# EAGLE design lortinchen (EAGLE 9.3.0)
Assembly variants: ohne LDO
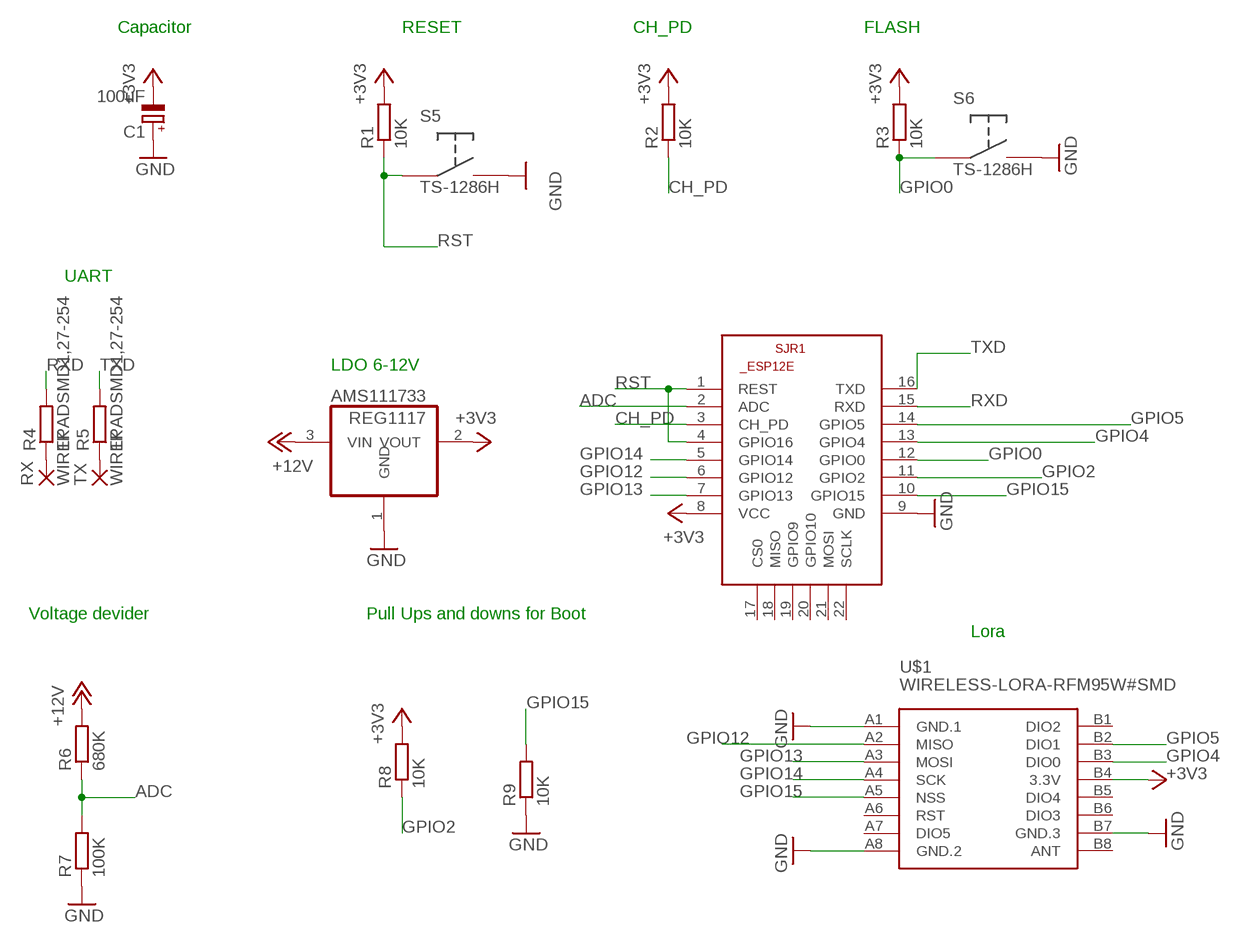
[diagram p0: schematic, sheet 1]

## Parts
AMS111733  REG1117  [SOT223]  (not fitted in variant ohne LDO)
C1  100uF  CPOL-EUC/6032-28R  [C/6032-28R]
R1  10K  R-EU_R0603  [R0603]
R2  10K  R-EU_R0603  [R0603]
R3  10K  R-EU_R0603  [R0603]
R4  1K  R-EU_R0603  [R0603]
R5  1K  R-EU_R0603  [R0603]
R6  680K  R-EU_R0603  [R0603]
R7  100K  R-EU_R0603  [R0603]
R8  10K  R-EU_R0603  [R0603]
R9  10K  R-EU_R0603  [R0603]
RX  WIREPADSMD1,27-254  [SMD1,27-2,54]
S5  TS-1286H  [TS-1268H]
S6  TS-1286H  [TS-1268H]
SJR1  ESP8266-12EESP12E  [ESP8266-ESP12E]
TX  WIREPADSMD1,27-254  [SMD1,27-2,54]
U$1  WIRELESS-LORA-RFM95W#SMD  [WIRELESS-LORA-RFM95W#SMD]

## Nets
+3V3 [Power]: AMS111733.2(VOUT) C1.- R1.2 R2.2 R3.2 R8.2 SJR1.8(VCC) U$1.B4(3.3V)
+12V [Power]: AMS111733.3(VIN) R6.2
ADC: R6.1 R7.2 SJR1.2(ADC)
CH_PD: R2.1 SJR1.3(CH_PD)
GND [Power]: AMS111733.1(GND) C1.+ R7.1 R9.1 S5.P$2 S6.P$2 SJR1.9(GND) U$1.A1(GND.1) U$1.A8(GND.2) U$1.B7(GND.3)
GPIO0: R3.1 S6.P$1 SJR1.12(GPIO0)
GPIO2: R8.1 SJR1.11(GPIO2)
GPIO4: SJR1.13(GPIO4) U$1.B3(DIO0)
GPIO5: SJR1.14(GPIO5) U$1.B2(DIO1)
GPIO12: SJR1.6(GPIO12) U$1.A2(MISO)
GPIO13: SJR1.7(GPIO13) U$1.A3(MOSI)
GPIO14: SJR1.5(GPIO14) U$1.A4(SCK)
GPIO15: R9.2 SJR1.10(GPIO15) U$1.A5(NSS)
N$1: R4.1 RX.1(P)
N$2: R5.1 TX.1(P)
RST: R1.1 S5.P$1 SJR1.1(REST) SJR1.4(GPIO16)
RXD: R4.2 SJR1.15(RXD)
TXD: R5.2 SJR1.16(TXD)
Unconnected: SJR1.17(CS0) SJR1.18(MISO) SJR1.19(GPIO9) SJR1.20(GPIO10) SJR1.21(MOSI) SJR1.22(SCLK) U$1.A6(RST) U$1.A7(DIO5) U$1.B1(DIO2) U$1.B5(DIO4) U$1.B6(DIO3) U$1.B8(ANT)

## Notes on the sheet
- Capacitor | RESET | CH_PD | FLASH
- UART
- LDO 6-12V
- Voltage devider | Pull Ups and downs for Boot
- Lora

## Library data of the parts
AMS111733 = burr-brown:REG1117: 800mA and 1A Low Dropout (LDO) Positive Regulator 1.8V, 2.5V, 2.85V, 3.3V, 5V, and Adj; MPN: REG1117; OC_FARNELL: 1097566; OC_NEWARK: 14P6981
C1 = rcl:CPOL-EU: POLARIZED CAPACITOR, European symbol; SPICEPREFIX: C
R1-R9 = rcl:R-EU_: RESISTOR, European symbol; SPICEPREFIX: R
RX TX = wirepad:WIREPAD: Wire PAD connect wire on PCB
S5 S6 = small-button:TS-1286H
SJR1 = esp12e:ESP8266-12E: ESP8266-12E Library for Eagle CAD The author not responsible for any damages or errors!. Created by Suhail jr.lt;/author>
U$1 = diy-modules:WIRELESS-LORA-RFM95W: 868/915 MHz LoRa Radio Transceiver Module based on SX1276 chip Click here to find device on ebay.com <http://www.ebay.com/sch/RFM95W+transceiver>

## Net classes
1 Power: width 0.254 mm, clearance 0.203 mm

## Board
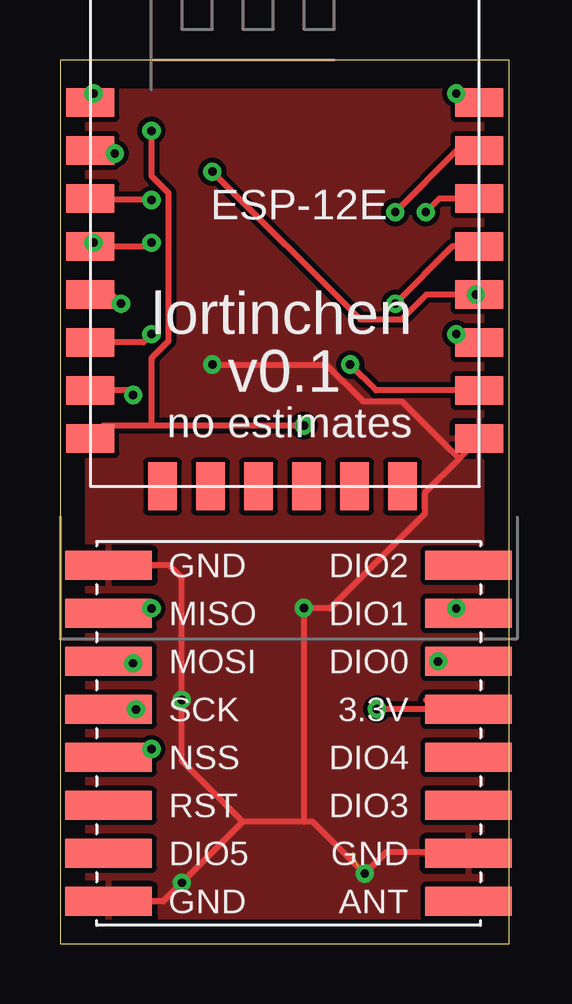
[diagram p1: board, top side]
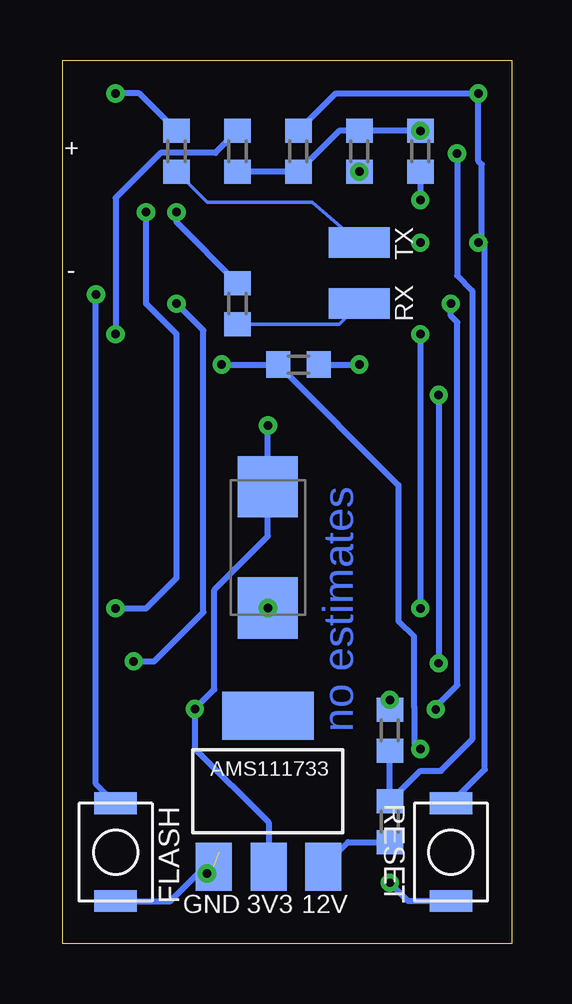
[diagram p2: board, bottom side, seen from below]

Size 18.72 x 36.82 mm. Coordinates in mm from the lower left corner, seen from the top.
Outline: 0,0 18.72,0 18.72,36.82 0,36.82 0,0
Copper layers (1*16): Top 0.035mm / dielectric 1.5mm / Bottom 0.035mm
Design rules "default *": minimum track width 6mil, minimum drill 0.35mm, track to track 6mil, track to pad 6mil, pad to pad 6mil, via to via 6mil, smd to smd 6mil, copper to edge 40mil, drill to drill 6mil, minimum pad ring 10mil, minimum via ring 8mil, stop-mask expansion 4mil, vias tented up to drill 15mil, thermal gap 10mil

### Footprints (pad centres in the part's own frame; a part is rotated, then mirrored left to right if it is on the bottom)
SOT223 = smd 1.499 x 2.007: 1 -2.261,-3.15; 2 0.025,-3.15; 3 2.311,-3.15 | smd 3.81 x 2.007: 4 0,3.15
C/6032-28R = smd 2.55 x 2.5: + 2.525,0; - -2.525,0
R0603 = smd 1 x 1.1: 1 -0.85,0; 2 0.85,0
SMD1,27-2,54 = smd 1.27 x 2.54: 1 0,0
TS-1268H = smd 0.914 x 1.778: P$1 -2.032,0; P$2 2.032,0
ESP8266-ESP12E = smd 2 x 1.2: 1 -7.62,5.84; 2 -7.62,3.84; 3 -7.62,1.84; 4 -7.62,-0.16; 5 -7.62,-2.16; 6 -7.62,-4.16; 7 -7.62,-6.16; 8 -7.62,-8.16; 9 8.58,-8.16; 10 8.58,-6.16; 11 8.58,-4.16; 12 8.58,-2.16; 13 8.58,-0.16; 14 8.58,1.84; 15 8.58,3.84; 16 8.58,5.84 | smd 1.2 x 2: 17 -4.62,-10.16; 18 -2.62,-10.16; 19 -0.62,-10.16; 20 1.38,-10.16; 21 3.38,-10.16; 22 5.38,-10.16
WIRELESS-LORA-RFM95W#SMD = smd 3.6 x 1.2: A1 -7.5,7; A2 -7.5,5; A3 -7.5,3; A4 -7.5,1; A5 -7.5,-1; A6 -7.5,-3; A7 -7.5,-5; A8 -7.5,-7; B1 7.5,7; B2 7.5,5; B3 7.5,3; B4 7.5,1; B5 7.5,-1; B6 7.5,-3; B7 7.5,-5; B8 7.5,-7

### Placement (x,y rotation side)
AMS111733  10.16,6.35 0 bottom  (not fitted)
C1  10.16,16.51 270 bottom
R1  8.89,33.02 270 bottom
R2  3.81,33.02 90 bottom
R3  6.35,33.02 90 bottom
R4  11.43,26.67 90 bottom
R5  13.97,33.02 90 bottom
R6  5.08,5.08 270 bottom
R7  5.08,8.89 270 bottom
R8  11.43,33.02 270 bottom
R9  8.89,24.13 180 bottom
RX  6.35,26.67 90 bottom
S5  2.54,3.81 270 bottom
S6  16.51,3.81 270 bottom
SJR1  8.89,29.21 0 top
TX  6.35,29.21 90 bottom
U$1  9.52,8.76 0 top

### Tracks (layer width: path | path; a pad name or v marks a point on that pad's centre or on a via)
+3V3  (via drill 0.35)
  Top 0.254: 15.24,10.16 15.64,9.76 U$1.B4 13.22,9.76 v13.21,9.78 | v10.16,21.59 3.81,21.59 | 3.81,21.59 1.81,21.59 SJR1.8 | R2.2 3.81,31.99 4.52,31.28 4.52,25.11 3.81,24.4 3.81,21.59
  Bottom 0.254: AMS111733.2 10.13,5.05 13.21,8.13 v13.21,9.78 12.39,10.59 12.39,14.74 10.16,16.98 C1.- v10.16,21.59 | R2.2 R3.2 7.19,33.87 R1.2 R8.2
  other vias: 3.81,33.87
+12V
  Bottom 0.254: AMS111733.3 6.82,4.23 R6.2
ADC  (via drill 0.35)
  Top 0.254: SJR1.2 2.16,33.05 v2.28,32.92
  Bottom 0.254: R7.2 R6.1 3.81,7.2 2.96,7.2 1.65,8.51 1.65,27.21 2.28,27.84 v2.28,32.92
CH_PD  (via drill 0.35)
  Top 0.254: v3.81,30.99 1.33,30.99 SJR1.3
  Bottom 0.254: R2.1 v3.81,30.99
GND  (via drill 0.35)  (1 unrouted)
  Top 0.254: U$1.A8 4.3,1.76 v5.08,2.54 7.62,5.08 | U$1.B7 16.98,3.81 13.59,3.81 v12.7,2.92 10.54,5.08 10.16,5.08 | C1.+ | C1.+ 10.16,5.08 | 10.16,5.08 7.62,5.08 | 7.62,5.08 5.08,7.62 v5.08,10.16 5.08,15.24 4.56,15.76 U$1.A1 | SJR1.9 16.62,20.2 | 16.62,20.2 15.2,18.78 15.2,17.91 11.26,13.97 C1.+ | 16.62,20.2 14.24,22.59 12.63,22.59 11.09,24.13 v6.35,24.13
  Bottom 0.254: S6.P$2 14.22,1.78 12.19,3.81 | R7.1 v5.08,10.16 | S5.P$2 4.32,1.78 v5.08,2.54 | AMS111733.1 v12.7,2.92 | R9.1 v6.35,24.13
  other vias: 10.16,13.98
  pour Top: -1.27,35.56 20.32,35.56 20.32,0 -1.27,0
GPIO0  (via drill 0.35)
  Top 0.254: SJR1.12 v17.33,27.05 15.28,27.05 14.24,26.01 12.51,26.01 R3.1
  Bottom 0.254: S6.P$1 17.33,6.66 v17.33,27.05
  other vias: 6.35,32.17
GPIO2  (via drill 0.35)
  Top 0.254: v16.51,25.4 16.86,25.05 SJR1.11
  Bottom 0.254: R8.1 12.35,32.95 14.64,32.95 16.51,31.08 v16.51,25.4
GPIO4  (via drill 0.35)
  Top 0.254: SJR1.13 16.35,29.05 v13.97,26.67 | U$1.B3 v15.75,11.76
  Bottom 0.254: v15.75,11.76 14.91,11.76 12.85,13.82 12.85,25.55 v13.97,26.67
GPIO5  (via drill 0.35)
  Top 0.254: U$1.B2 16.82,13.97 v16.51,13.97 | v15.24,30.48 15.81,31.05 SJR1.14
  Bottom 0.254: v16.51,13.97 15.24,13.97 13.97,15.24 13.97,25.4 15.24,26.67 v15.24,30.48
GPIO12  (via drill 0.35)
  Top 0.254: U$1.A2 2.23,13.97 v3.81,13.97 | v3.81,25.4 3.46,25.05 SJR1.6
  Bottom 0.254: v3.81,25.4 v3.81,13.97
GPIO13  (via drill 0.35)
  Top 0.254: U$1.A3 2.23,11.56 2.92,11.56 v3.05,11.68 | v3.05,22.86 2.86,23.05 SJR1.7
  Bottom 0.254: v3.05,22.86 v3.05,11.68
GPIO14  (via drill 0.35)
  Top 0.254: v2.54,26.67 2.16,27.05 SJR1.5 | U$1.A4 v3.17,9.76
  Bottom 0.254: v3.17,9.76 3.17,9.87 2.26,10.78 2.26,25.88 2.54,26.16 v2.54,26.67
GPIO15  (via drill 0.35)
  Top 0.254: SJR1.10 13.17,23.05 v12.09,24.13 | v3.81,8.11 3.46,7.76 U$1.A5
  Bottom 0.254: v12.09,24.13 R9.2 4.72,19.11 4.72,13.44 4.08,12.8 4.08,9.87 4.06,9.86 4.06,8.37 v3.81,8.11
N$1
  Bottom 0.152: R4.1 7.2,25.82 RX.1
N$2
  Bottom 0.152: R5.1 12.7,30.9 8.32,30.9 TX.1
RST  (via drill 0.35)
  Top 0.254: v1.39,35.43 1.39,35.17 SJR1.1 | v3.81,29.21 3.65,29.05 SJR1.4 1.27,29.09 v1.39,29.21
  Bottom 0.254: R1.1 7.33,35.43 v1.39,35.43 1.39,32.61 1.24,32.46 1.24,29.21 | S5.P$1 1.12,7.26 1.12,29.21 1.24,29.21 | 1.24,29.21 v1.39,29.21
RXD  (via drill 0.35)
  Top 0.254: v13.97,30.48 16.54,33.05 SJR1.15
  Bottom 0.254: R4.2 13.97,30.06 v13.97,30.48
TXD  (via drill 0.35)
  Top 0.254: v16.51,35.43 17.09,35.43 SJR1.16
  Bottom 0.254: R5.2 15.53,35.43 v16.51,35.43

### Text on the board
Bottom: no estimates
tPlace: lortinchen | v0.1 | no estimates
bNames: + | - | RESET | FLASH | 12V | 3V3 | GND
bValues: +